# EAGLE design oled2 (EAGLE 7.2.0)
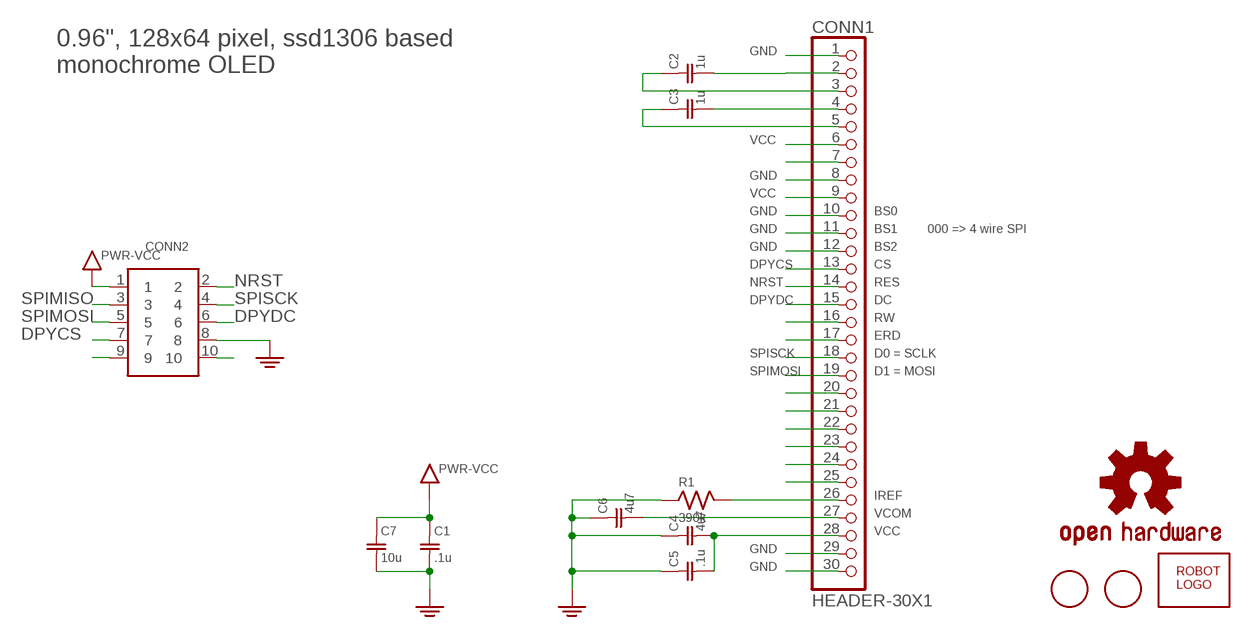
[diagram p0: schematic, sheet 1]

## Parts
C1  .1u  C0603  [SMD0603]
C2  1u  C0603  [SMD0603]
C3  1u  C0603  [SMD0603]
C4  4u7  C0603  [SMD0603]
C5  .1u  C0603  [SMD0603]
C6  4u7  C0603  [SMD0603]
C7  10u  C0603  [SMD0603]
CONN1  HEADER-30X1  [HEADER-30X1-SMD7]
CONN2  HEADER-5X2-PTH  [HEADER-5X2-PTH]
LOGO1  OSHW-LOGOS  [OSHW-LOGO-S]
R1  390k  R0603  [SMD0603]
U$1  FIDUCIAL  [FIDUCIAL_1MM]
U$2  FIDUCIAL  [FIDUCIAL_1MM]
U$3  ROBOTMAN-LOGO2  [ROBOTMAN-LOGO2]

## Nets
DPYCS: CONN1.13 CONN2.7
DPYDC: CONN1.15 CONN2.6
GND: C1.2 C4.1 C5.1 C6.1 C7.2 CONN1.1 CONN1.8 CONN1.10 CONN1.11 CONN1.12 CONN1.29 CONN1.30 CONN2.8 R1.1 ; supply symbol labelled PWR-GND
N$3: C2.2 CONN1.2
N$4: C2.1 CONN1.3
N$5: C3.2 CONN1.4
N$6: C3.1 CONN1.5
N$8: CONN1.7
N$12: CONN2.9
N$17: CONN1.16
N$18: CONN1.17
N$19: CONN2.10
N$21: CONN1.20
N$22: CONN1.21
N$23: CONN1.22
N$24: CONN1.23
N$25: CONN1.24
N$26: CONN1.25
N$27: CONN1.26 R1.2
N$28: C6.2 CONN1.27
N$29: C4.2 C5.2 CONN1.28
NRST: CONN1.14 CONN2.2
SPIMISO: CONN2.3
SPIMOSI: CONN1.19 CONN2.5
SPISCK: CONN1.18 CONN2.4
VCC: C1.1 C7.1 CONN1.6 CONN1.9 CONN2.1 ; supply symbol labelled PWR-VCC

## Notes on the sheet
- 0.96", 128x64 pixel, ssd1306 based
  monochrome OLED
- BS0
- BS1 | 000 => 4 wire SPI
- BS2
- CS
- RES
- DC
- RW
- ERD
- D0 = SCLK
- D1 = MOSI
- IREF
- VCOM
- VCC

## Library data of the parts
C1-C7 = jaw:C
CONN1 = jaw:HEADER-30X1
CONN2 = jaw:HEADER-5X2
LOGO1 = Sparkfun-Aesthetics:OSHW-LOGO: Open Source Hardware Logo This logo indicates the piece of hardware it is found on incorporates a OSHW license and/or adheres to the definition of open source hardware found here: http://freedomdefined.org/OSHW
R1 = jaw:R
U$1 U$2 = adafruit:FIDUCIAL: For use by pick and place machines to calibrate the vision/machine, 1mm By microbuilder.eu
U$3 = jaw:ROBOTMAN-LOGO

## Board
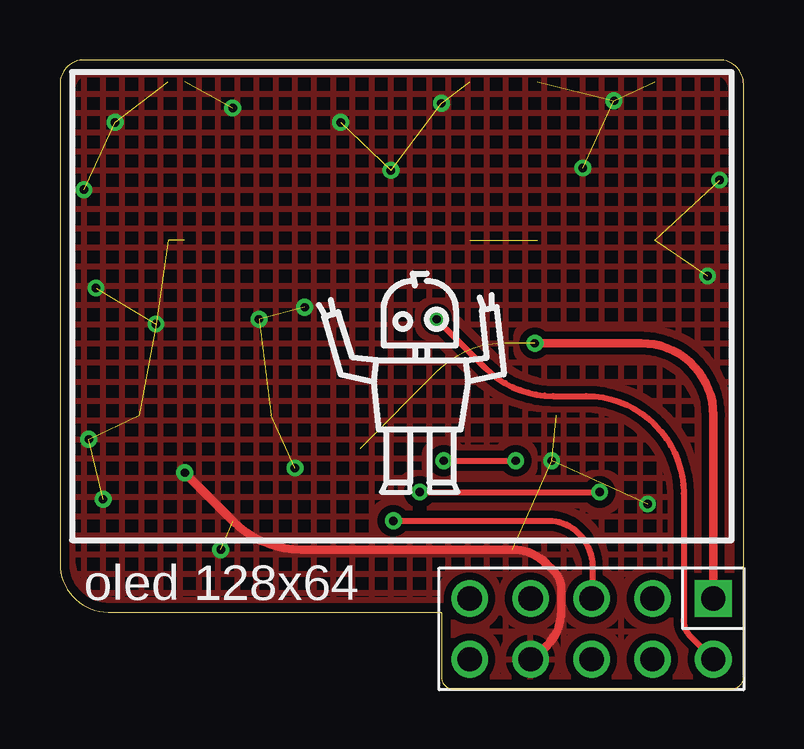
[diagram p1: board, top side]
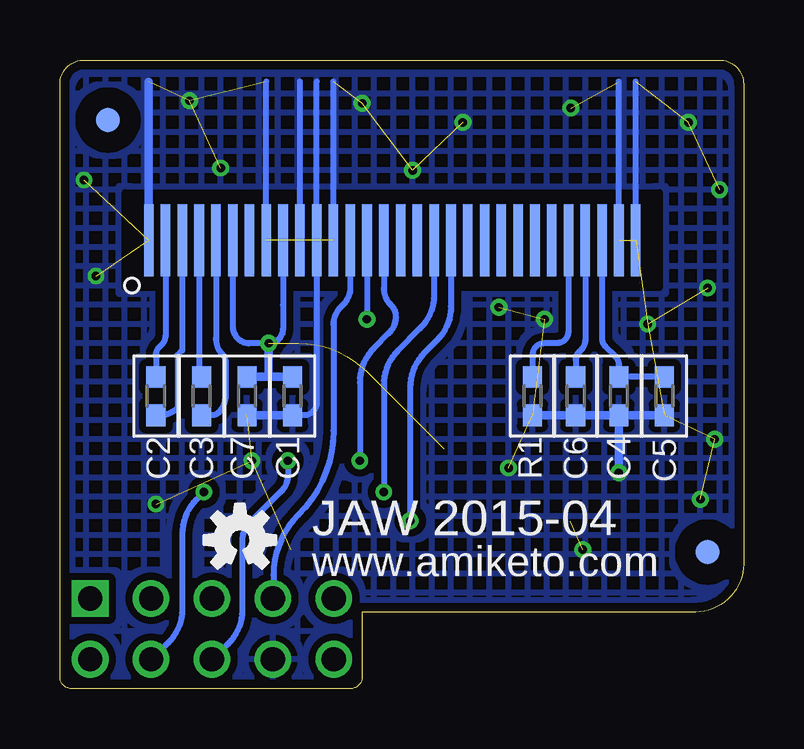
[diagram p2: board, bottom side, seen from below]

Size 28.5 x 26.2 mm. Coordinates in mm from the lower left corner, seen from the top.
Outline: 16.4,0 28,0 arc90 28.5,0.5 28.5,25.2 arc90 27.5,26.2 1,26.2 arc90 0,25.2 0,5.2 arc90 2,3.2 15.9,3.2 15.9,0.5 arc90 16.4,0
Copper layers (1*16): Top 0.0356mm / dielectric 1.5011mm / Bottom 0.0356mm
Design rules "LaenPCBOrder *": minimum track width 6mil, minimum drill 13mil, track to track 6mil, track to pad 6mil, pad to pad 6mil, via to via 6mil, smd to smd 6mil, copper to edge 15mil, drill to drill 6mil, minimum pad ring 10mil, minimum via ring 7mil, stop-mask expansion 4mil, vias tented up to drill 0.35mm, thermal gap 10mil

### Footprints (pad centres in the part's own frame; a part is rotated, then mirrored left to right if it is on the bottom)
SMD0603 = smd 0.9 x 0.8: 1 -0.8,0; 2 0.8,0
HEADER-30X1-SMD7 = smd 0.4 x 3: 1 -9.8,0; 2 -9.1,0; 3 -8.4,0; 4 -7.7,0; 5 -7,0; 6 -6.3,0; 7 -5.6,0; 8 -4.9,0; 9 -4.2,0; 10 -3.5,0; 11 -2.8,0; 12 -2.1,0; 13 -1.4,0; 14 -0.7,0; 15 0,0; 16 0.7,0; 17 1.4,0; 18 2.1,0; 19 2.8,0; 20 3.5,0; 21 4.2,0; 22 4.9,0; 23 5.6,0; 24 6.3,0; 25 7,0; 26 7.7,0; 27 8.4,0; 28 9.1,0; 29 9.8,0; 30 10.5,0
HEADER-5X2-PTH = drill 1.016 square: 1 -5.08,-1.27 | drill 1.016: 2 -5.08,1.27; 3 -2.54,-1.27; 4 -2.54,1.27; 5 0,-1.27; 6 0,1.27; 7 2.54,-1.27; 8 2.54,1.27; 9 5.08,-1.27; 10 5.08,1.27
FIDUCIAL_1MM = smd 1 x 1: 1 0,0

### Placement (x,y rotation side)
C1  20.7,12.2 270 bottom
C2  24.5,12.2 90 bottom
C3  22.6,12.2 90 bottom
C4  5.2,12.2 90 bottom
C5  3.3,12.2 90 bottom
C6  7,12.2 90 bottom
C7  18.8,12.2 270 bottom
CONN1  15,18.7 0 bottom
CONN2  22.16,2.5 180 top
LOGO1  21,6.2 0 bottom
R1  8.8,12.2 90 bottom
U$1  26.5,23.7 0 bottom
U$2  1.5,5.7 0 bottom
U$3  15,12.6 0 top

### Tracks (layer width: path | path; a pad name or v marks a point on that pad's centre or on a via)
DPYCS
  Bottom 0.25: CONN1.13 16.4,16.71 arc45 16.69,16.01 16.81,15.89 arc-45 17.1,15.19 17.1,10.77 arc45 18.56,7.24 arc-45 19.6,4.74 19.6,3.78 19.6,3.78 arc45 CONN2.7
DPYDC  (via drill 0.35)
  Top 0.25: v16,9.5 v19,9.5
  Bottom 0.25: v19,9.5 19,8.91 arc45 19.29,8.21 20.61,6.89 arc-45 20.9,6.19 20.9,3.29 arc45 21.49,1.87 22.11,1.25 arc45 CONN2.6 | CONN1.15 15,16.7 arc-45 14.71,15.99 14.69,15.98 arc45 14.5,15.51 arc45 14.79,14.81 15.41,14.19 arc-45 16,12.77 v16,9.5
GND  (via drill 0.35)  (27 unrouted)
  Top 0.25: 19.73,1.23 CONN2.8
  Top 0.35: 19.73,1.23 20.31,1.81 arc45 20.9,3.23 20.9,4.19 arc45 20.61,4.89 20.29,5.21 arc45 18.87,5.8 10.06,5.8 arc-45 7.23,6.97 v5.2,9
  Bottom 0.25: CONN1.8 19.9,25.3 | CONN1.10 18.5,25.3 | 17.8,25.3 CONN1.11 17.8,14.1 17.8,11.91 arc45 17.95,11.55 17.95,11.55 arc45 18.31,11.4 C7.2 | CONN1.29 5.2,25.3 | CONN1.30 4.5,25.3 | CONN1.12 17.1,25.3
  Bottom 0.35: C5.1 C4.1 | C4.1 C6.1 R1.1 | v5.2,9 C4.1 | CONN1.1 24.8,25.3 | C7.2 C1.2
  other vias: 1,20.8 23.1,24.5 11.7,23.6 1.2,10.4 1.8,7.9 9.8,9.2 24.5,7.7 7.2,24.2 15.9,24.4 4,15.2 2.3,23.6 27.5,21.2 10.2,15.9 8.3,15.4 13.8,21.6 27,17.2 1.5,16.7 21.8,21.7 20.5,9.5 6.7,5.8
  pour Top (isolate 0.3, hatched): -0.5,29.2 -0.5,-0.3 29,-0.3 29,29.2
  pour Bottom (isolate 0.3, hatched): -0.5,29.2 -0.5,-0.3 29,-0.3 29,29.2
N$2
  cutout Bottom: 3.5,20.7 3.5,16.7 25.8,16.7 25.8,20.7
N$3
  Bottom 0.25: CONN1.2 24.1,14.71 arc45 24.25,14.35 24.35,14.25 arc-45 24.5,13.89 C2.2
N$4
  Bottom 0.25: CONN1.3 23.4,14.1 23.6,13.9 23.6,11.71 arc45 23.61,11.69 arc45 24.31,11.4 C2.1
N$5
  Bottom 0.25: 22.7,13.2 C3.2 22.7,13.1 CONN1.4
N$6
  Bottom 0.25: CONN1.5 22,14.61 arc-45 21.71,13.91 arc45 21.6,13.65 21.6,12.21 arc45 21.89,11.51 arc45 22.15,11.4 C3.1
N$27
  Bottom 0.25: CONN1.26 7.3,14.9 arc90 7.8,14.4 8,14.4 8.3,14.4 arc-90 8.8,13.9 R1.2
N$28
  Bottom 0.25: CONN1.27 6.6,14.51 arc45 6.75,14.15 6.85,14.05 arc-45 7,13.69 C6.2
N$29
  Bottom 0.25: CONN1.28 5.9,14.61 arc-45 5.75,14.25 5.35,13.85 arc45 5.2,13.49 C4.2 C5.2
NRST  (via drill 0.35)
  Top 0.25: CONN2.2 26.29,2.18 arc-45 26,2.88 26,8.14 arc45 24.83,10.97 24.77,11.03 arc45 21.94,12.2 20.56,12.2 arc-45 17.73,13.37 v15.7,15.4
  Bottom 0.25: CONN1.14 v15.7,15.4
SPIMOSI  (via drill 0.35)
  Top 0.25: v13.9,7 20.37,7 arc-45 21.61,6.49 arc-45 22.2,5.07 22.2,3.84 22.18,3.82 arc45 CONN2.5
  Bottom 0.25: CONN1.19 12.2,15.93 arc45 12.79,14.51 13.31,13.99 arc-45 13.9,12.57 v13.9,7
SPISCK  (via drill 0.35)
  Top 0.25: v15,8.2 v22.5,8.2
  Bottom 0.25: CONN1.18 12.9,16.43 arc45 13.49,15.01 14.41,14.09 arc-45 15,12.67 v15,8.2 | v22.5,8.2 22.81,7.89 arc-45 23.4,6.47 23.4,3.33 arc45 23.99,1.91 24.65,1.25 arc45 CONN2.4
VCC  (via drill 0.35)  (4 unrouted)
  Top 0.35: CONN2.1 27.24,11.4 arc90 24.24,14.4 20.4,14.4 v19.8,14.4
  Bottom 0.25: CONN1.6 21.3,15.1 arc-90 20.6,14.4 v19.8,14.4 arc-90 19.2,15 19.2,16 CONN1.9
  Bottom 0.35: C7.1 19.8,13 | 19.8,13 C1.1 | v19.8,14.4 19.8,13.6 19.8,13

### Text on the board
tPlace: oled 128x64
bPlace: JAW 2015-04 | www.amiketo.com